# Altium schematic sheet controller-4layer.SchDoc
size A4
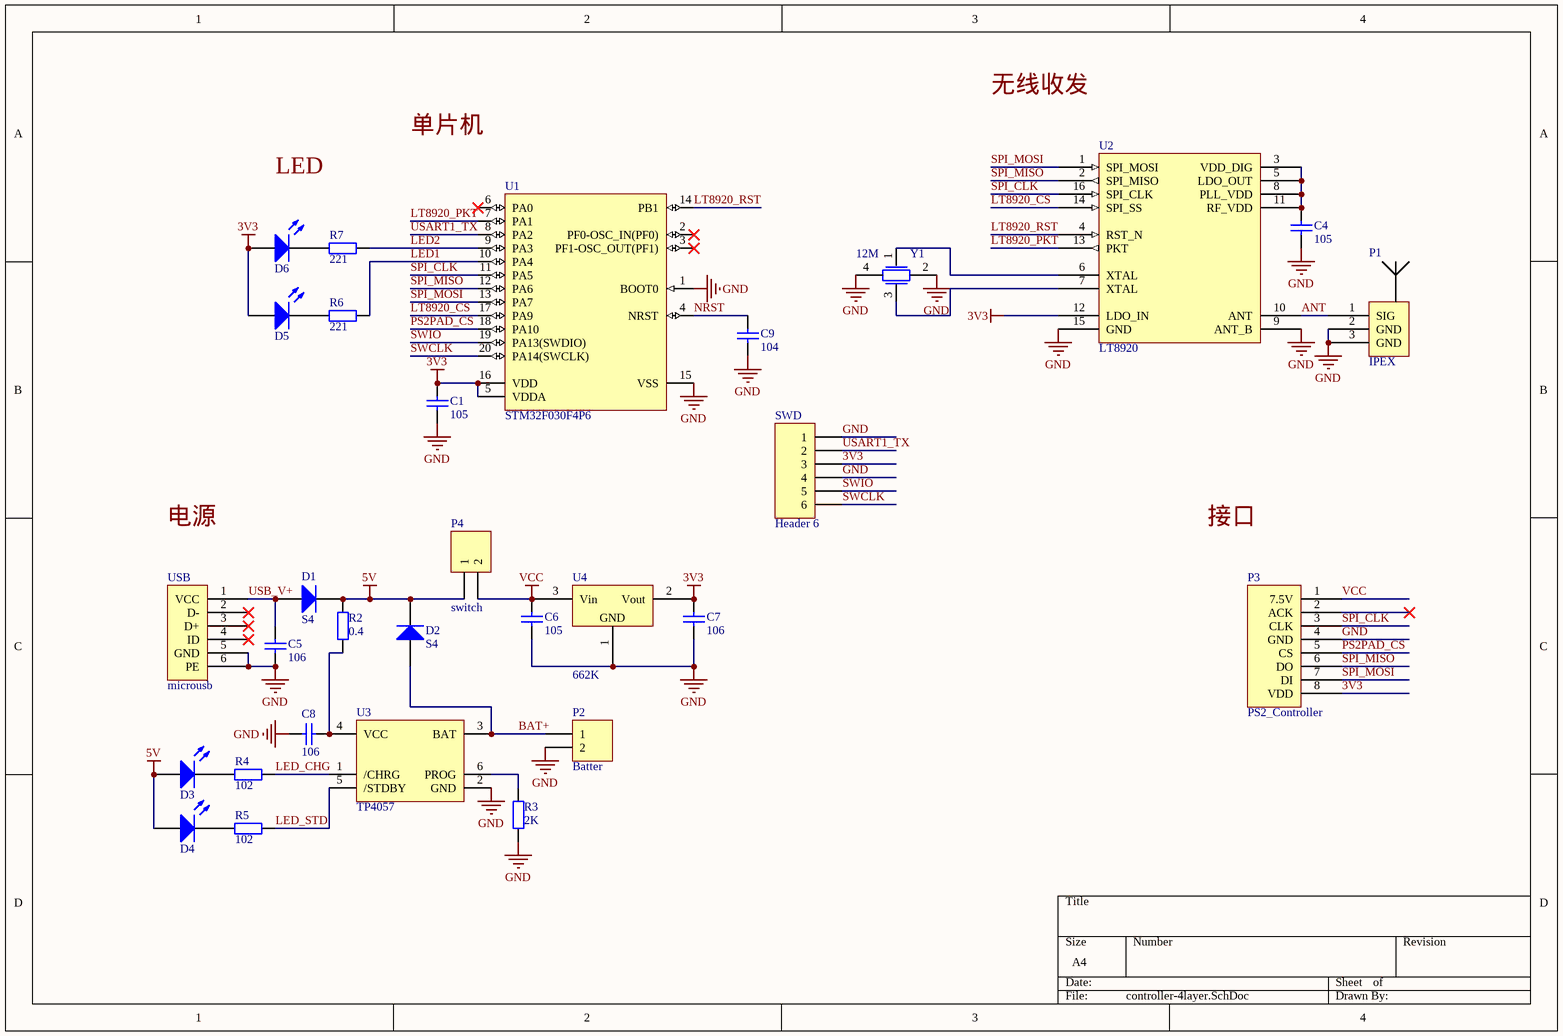
[diagram p0: controller-4layer.SchDoc]

## Parts
C1  value 105  [0805-2]  (hidden comment: Cap)
C4  value 105  [0805-2]  (hidden comment: Cap)
C5  value 106  [0805-2]  (hidden comment: Cap)
C6  value 105  [0805-2]  (hidden comment: Cap)
C7  value 106  [0805-2]  (hidden comment: Cap)
C8  value 106  [0805-2]  (hidden comment: Cap)
C9  value 104  [0805-2]  (hidden comment: Cap)
D1  S4  [SOD523]
D2  S4  [SOD523]
D3  LED0  [LED_0805]  (value not drawn)
D4  LED0  [LED_0805]  (value not drawn)
D5  LED0  [LED_0805]  (value not drawn)
D6  LED0  [LED_0805]  (value not drawn)
P1  IPEX  [U.FL-R-SMT]
P2  Batter  [HDR1X2]
P3  PS2_Controller  [HDR8X1_A]
P4  switch  [HDR1X2]
R2  value 0.4  [1210]  (hidden comment: Res1)
R3  value 2K  [0805-2]  (hidden comment: Res1)
R4  value 102  [0805-2]  (hidden comment: Res1)
R5  value 102  [0805-2]  (hidden comment: Res1)
R6  value 221  [0805-2]  (hidden comment: Res1)
R7  value 221  [0805-2]  (hidden comment: Res1)
SWD  Header 6  [HDR6*1*1.27]
U1  STM32F030F4P6  [STM-TSSOP20_N]
U2  LT8920  [SSOP-16 LT8920]
U3  TP4057  [SOT23-6]
U4  662K  [SOT-23]
USB  microusb  [MICROUSB_1]
Y1  12M  [XTAL_3225]

## Nets
3V3: C1.1 C7.1 D5.1(A) D6.1(A) P3.8(VDD) SWD.3 U1.5(VDDA) U1.16(VDD) U2.12(LDO_IN) U4.2(Vout)
5V: D1.2(K) D2.2(K) D3.1(A) D4.1(A) P4.1 R2.2
GND: C1.2 C4.1 C5.2 C6.2 C7.2 C8.2 C9.2 P1.2(GND) P1.3(GND) P2.2 P3.4(GND) R3.1 SWD.1 SWD.4 U1.1(BOOT0) U1.15(VSS) U2.9(ANT_B) U2.15(GND) U3.2(GND) U4.1(Vss) USB.5(GND) USB.6(PE) Y1.2 Y1.4
VCC: C6.1 P3.1(7.5V) P4.2 U4.3(Vin)
ANT: P1.1(SIG) U2.10(ANT)
BAT+: D2.1(A) P2.1 U3.3(BAT)
LED1: R6.1 U1.10(PA4)
LED2: R7.1 U1.9(PA3)
LED_CHG: R4.1 U3.1(/CHRG)
LED_STD: R5.1 U3.5(/STDBY)
LT8920_CS: U1.17(PA9) U2.14(SPI_SS)
LT8920_PKT: U1.7(PA1) U2.13(PKT)
LT8920_RST: U1.14(PB1) U2.4(RST_N)
NRST: C9.1 U1.4(NRST)
PS2PAD_CS: P3.5(CS) U1.18(PA10)
SPI_CLK: P3.3(CLK) U1.11(PA5) U2.16(SPI_CLK)
SPI_MISO: P3.6(DO) U1.12(PA6) U2.2(SPI_MISO)
SPI_MOSI: P3.7(DI) U1.13(PA7) U2.1(SPI_MOSI)
SWCLK: SWD.6 U1.20(PA14(SWCLK))
SWIO: SWD.5 U1.19(PA13(SWDIO))
USART1_TX: SWD.2 U1.8(PA2)
USB_V+: C5.1 D1.1(A) USB.1(VCC)
NetC4_2: C4.2 U2.3(VDD_DIG) U2.5(LDO_OUT) U2.8(PLL_VDD) U2.11(RF_VDD)
NetC8_1: C8.1 R2.1 U3.4(VCC)
NetD3_2: D3.2(K) R4.2
NetD4_2: D4.2(K) R5.2
NetD5_2: D5.2(K) R6.2
NetD6_2: D6.2(K) R7.2
NetR3_2: R3.2 U3.6(PROG)
NetU2_6: U2.6(XTAL) Y1.1
NetU2_7: U2.7(XTAL) Y1.3

Not connected (* = marked no-connect by the designer): P3 2(ACK)*; U1 2(PF0-OSC_IN(PF0))* 3(PF1-OSC_OUT(PF1))* 6(PA0)*; USB 2(D-)* 3(D+)* 4(ID)*

## Notes on the sheet
- 无线收发
- LED
- 单片机
- 电源
- 接口
- (in symbol 662K) GND

## Library data of the parts
C1 C4-C9 = Cap: 无极性电容; Published: 8-Jun-2000; LatestRevisionDate: 17-Jul-2002; LatestRevisionNote: Re-released for DXP Platform.; PackageReference: RAD-0.3; Publisher: Altium Limited
D1 D2 = Diode: Default Diode; Published: 8-Jun-2000; LatestRevisionDate: 17-Jul-2002; LatestRevisionNote: Re-released for DXP Platform.; PackageVersion: Sep-1996; PackageReference: SMC; Publisher: Altium Limited; PackageDescription: DO-214-AB/SMC; 2 C-Bend Leads; Body 7.9 x 5.9 mm, inc. leads (LxW); Code_JEDEC: DO-214-AB
D3-D6 = LED0: 发光二极管; Published: 8-Jun-2000; LatestRevisionDate: 08-Jul-2005; LatestRevisionNote: Mech Layer 1 removed.; PackageReference: LED-0; Publisher: Altium Limited
P1 = IPEX: U.FL-R-SMT
P2 P4 = Header 2: Header, 2-Pin; LatestRevisionDate: 17-Jul-2002; LatestRevisionNote: Re-released for DXP Platform.; Publisher: Altium Limited
R2-R7 = Res1: 贴片电阻; Published: 8-Jun-2000; LatestRevisionDate: 17-Jul-2002; LatestRevisionNote: Re-released for DXP Platform.; PackageReference: AXIAL-0.4; Publisher: Altium Limited
SWD = Header 6: 接插件; LatestRevisionDate: 17-Jul-2002; LatestRevisionNote: Re-released for DXP Platform.; Publisher: Altium Limited
U1 = STM32F030F4P6: ARM Cortex-M0 32-bit MCU, 16 KB Flash, 4 KB Internal RAM, 15 I/Os, 20-pin TSSOP, -40 to 85 degC, Tube; FLASH Size (Prog) (kB): 16; I/Os (High Current): 15; Internal RAM Size (kB): 4; Operating Frequency(F) (Processor speed) (MHz): 48; Supply Voltage(Vcc) min (V): 2.4; DatasheetVersion: Rev. 1; PackageVersion: Rev. 1, 11/2012; PackageReference: TSSOP20; PackageDescription: 20-Pin Thin Shrink Small Outline Package, 6.5 x 4.4 mm Body, 0.65 mm Pitch; Supplier 1: Digi-Key; Supplier Part Number 1: 497-14044-5-ND; Supplier 2: Newark; Supplier Part Number 2: 06X3648; Supplier 3: Mouser; Supplier Part Number 3: 511-STM32F030F4P6; Core: ARM Cortex-M0; Packing: Tube; Mounting Technology: Surface Mount; PartNumber: STM32F030F4P6; ComponentLink1Description: Manufacturer URL; ComponentLink1URL: http://www.st.com/web/en/home.html; ComponentLink2Description: Datasheet; ComponentLink2URL: http://www.st.com/st-web-ui/static/active/en/resource/technical/document/datasheet/DM00088500.pdf; ComponentLink3Description: Package Specification; ComponentLink3URL: http://www.st.com/st-web-ui/static/active/en/resource/technical/document/datasheet/DM00065136.pdf
U3 = TP4057: l锂电池管理芯片
Y1 = XTAL-4PIN: 贴片晶振